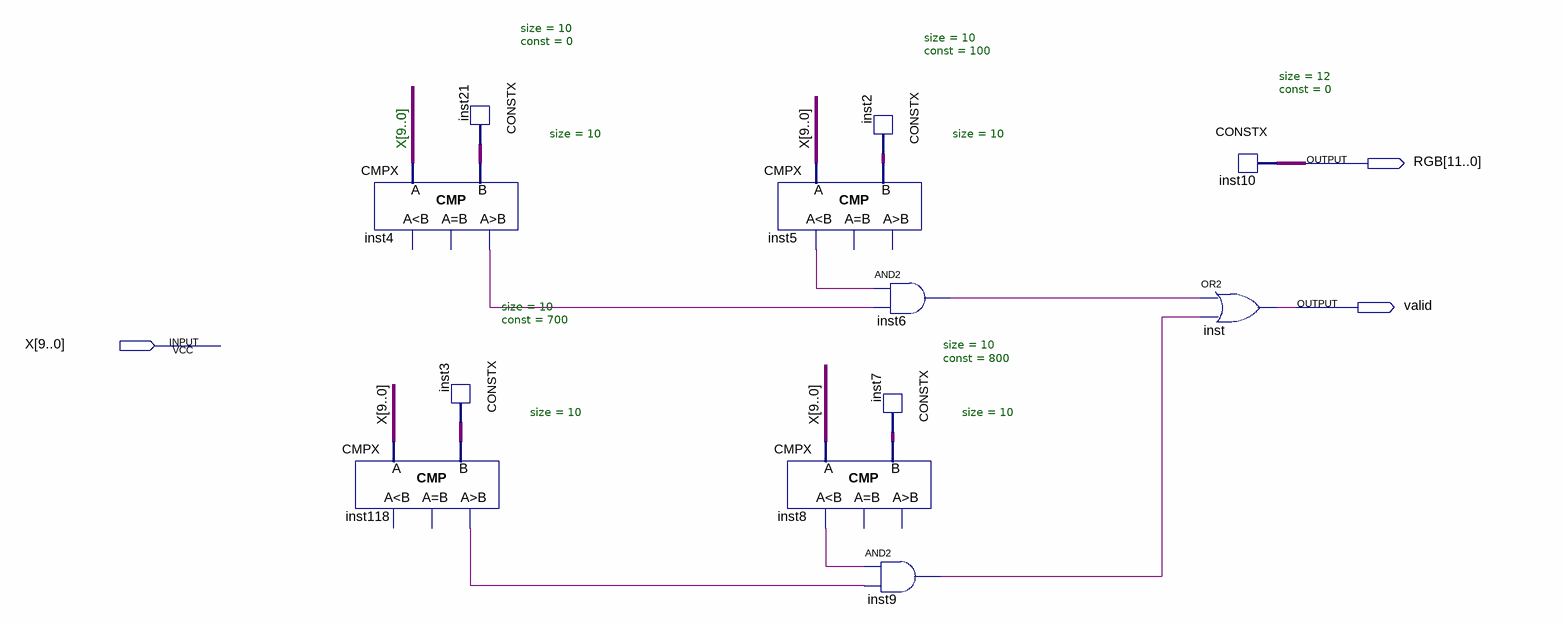
[diagram p0: schematic sheet]
// Quartus schematic Podloga.bdf as structural Verilog: 12 symbols, 3 pins
module Podloga (
  input  [9:0] X,
  output [11:0] RGB,
  output valid
);

  wire inst4_gr, inst5_ls, inst6_out, inst8_ls, inst9_out, inst118_gr;
  wire [9:0] inst2_data, inst3_data, inst7_data, inst21_data;

  CMPX #(.size(10)) inst118 (.A(X), .B(inst3_data), .gr(inst118_gr));  // open: ls, eq
  CMPX #(.size(10)) inst4 (.A(X), .B(inst21_data), .gr(inst4_gr));  // open: ls, eq
  CONSTX #(.size(10), .\const (0)) inst21 (.data(inst21_data));
  CONSTX #(.size(10), .\const (700)) inst3 (.data(inst3_data));
  CMPX #(.size(10)) inst5 (.A(X), .B(inst2_data), .ls(inst5_ls));  // open: eq, gr
  CMPX #(.size(10)) inst8 (.A(X), .B(inst7_data), .ls(inst8_ls));  // open: eq, gr
  CONSTX #(.size(10), .\const (100)) inst2 (.data(inst2_data));
  and inst6 (inst6_out, inst5_ls, inst4_gr);
  CONSTX #(.size(10), .\const (800)) inst7 (.data(inst7_data));
  and inst9 (inst9_out, inst8_ls, inst118_gr);
  CONSTX #(.size(12), .\const (0)) inst10 (.data(RGB));
  or inst (valid, inst6_out, inst9_out);

  // Notes on the sheet:
  //   X[9..0]
endmodule
